# EAGLE design frontend_v2 (EAGLE 9.1.1)
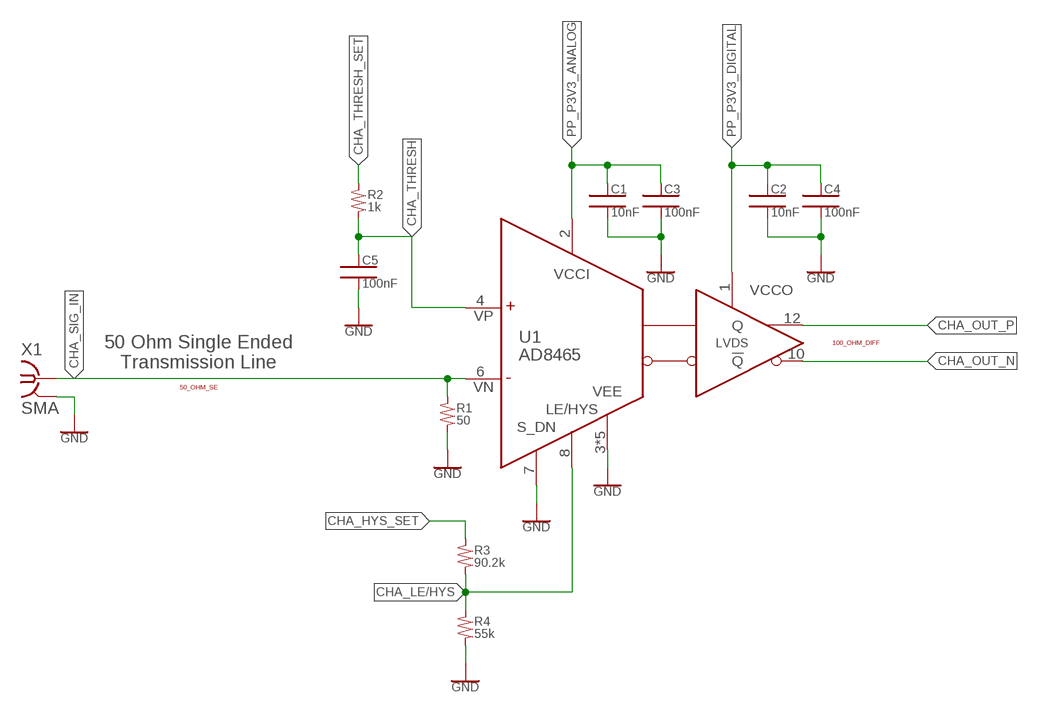
[diagram p0: schematic, sheet 1]

## Parts
C1  10nF  CAP_0402  [0402]
C2  10nF  CAP_0402  [0402]
C3  100nF  CAP_0402  [0402]
C4  100nF  CAP_0402  [0402]
C5  100nF  CAP_0402  [0402]
R1  50  RES_0402  [0402]
R2  1k  RES_0402  [0402]
R3  90.2k  RES_0402  [0402]
R4  55k  RES_0402  [0402]
U1  AD8465  [LFCSP-12]
X1  SMA  [J502-ND-142-0701-881/886]

## Nets
CHA_HYS_SET: R3.1
CHA_LE/HYS: R3.2 R4.1 U1.8(LE/HYS)
CHA_OUT_N [100_OHM_DIFF]: U1.10(!Q)
CHA_OUT_P [100_OHM_DIFF]: U1.12(Q)
CHA_SIG_IN: R1.1 U1.6(VN) X1.1
CHA_THRESH: C5.1 R2.2 U1.4(VP)
CHA_THRESH_SET: R2.1
GND: C1.2 C2.2 C3.2 C4.2 C5.2 R1.2 R4.2 U1.3(VEE) U1.5(VEE) U1.7(SDN) U1.9(VEE) U1.11(VEE) U1.EPAD(VEE) X1.G@1(GND) X1.G@2(GND) X1.G@3(GND) X1.G@4(GND)
PP_P3V3_ANALOG: C1.1 C3.1 U1.2(VCCI)
PP_P3V3_DIGITAL: C2.1 C4.1 U1.1(VCCO)

## Notes on the sheet
- 100_OHM_DIFF
- 50 Ohm Single Ended
  Transmission Line
- 50_OHM_SE

## Library data of the parts
C1-C5 = tcspc_lib:CAP
R1-R4 = tcspc_lib:RES
U1 = tcspc_lib:AD8465
X1 = tcspc_lib:SMA

## Net classes
1 50_OHM_SE: width 0.203 mm
2 100_OHM_DIFF: width 0.152 mm, clearance 0.29 mm

## Board
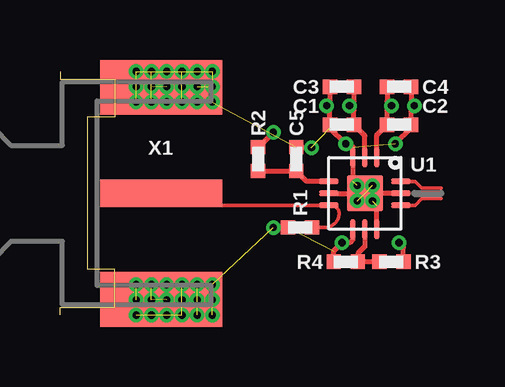
[diagram p1: board, top side]
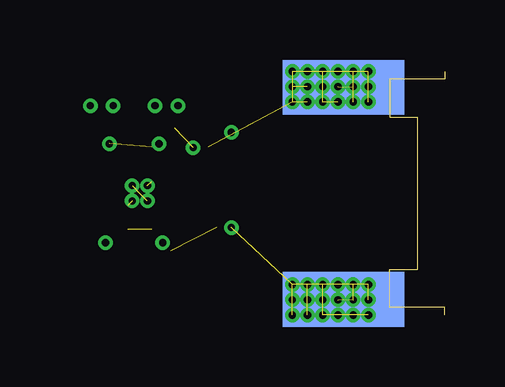
[diagram p2: board, bottom side, seen from below]

Size 2.29 x 10.16 mm. Coordinates in mm from the lower left corner, seen from the top.
Outline: 0,0 0,0.32 2.29,0.32 2.29,1.91 1.14,1.91 1.14,8.25 2.29,8.25 2.29,9.84 0,9.84 0,10.16
Copper layers (1+2*15+16): Top 0.035mm / dielectric 1.5mm / Route2 0.035mm / dielectric 0.15mm / Route15 0.035mm / dielectric 0.2mm / Bottom 0.035mm
Design rules "3PCB_4layer": minimum track width 6mil, minimum drill 0.3mm, track to track 6mil, track to pad 6mil, pad to pad 6mil, via to via 6mil, smd to smd 0mil, copper to edge 6mil, drill to drill 6mil, minimum pad ring 6mil, minimum via ring 6mil, stop-mask expansion 2mil, vias tented up to drill 0.3mm, thermal gap 10mil

### Footprints (pad centres in the part's own frame; a part is rotated, then mirrored left to right if it is on the bottom)
0402 = smd 0.6 x 0.6: 1 -0.5,0; 2 0.5,0
LFCSP-12 = smd 0.8 x 0.23: 1 -1.5,0.5; 2 -1.5,0; 3 -1.5,-0.5; 7 1.5,-0.5; 8 1.5,0; 9 1.5,0.5 | smd 0.23 x 0.8: 4 -0.5,-1.5; 5 0,-1.5; 6 0.5,-1.5; 10 0.5,1.5; 11 0,1.5; 12 -0.5,1.5 | smd 1.5 x 1.5: EPAD 0,0
J502-ND-142-0701-881/886 = smd 5.08 x 1.143: 1 2.565,0 | smd 5.08 x 2.286: G@1 2.565,4.42; G@2 2.565,-4.42 | smd 5.08 x 2.286 bottom: G@3 2.565,4.42; G@4 2.565,-4.42

### Placement (x,y rotation side)
C1  11.75,7.94 180 top  (outside the outline)
C2  14.13,7.94 0 top  (outside the outline)
C3  11.75,9.53 180 top  (outside the outline)
C4  14.13,9.53 0 top  (outside the outline)
C5  9.84,6.51 90 top  (outside the outline)
R1  10,3.65 180 top  (outside the outline)
R2  8.26,6.51 270 top  (outside the outline)
R3  13.81,2.22 180 top  (outside the outline)
R4  11.91,2.22 180 top  (outside the outline)
U1  12.7,5.08 270 top  (outside the outline)
X1  1.65,5.08 0 top

### Tracks (layer width: path | path; a pad name or v marks a point on that pad's centre or on a via)
CHA_HYS_SET  (via drill 0.3)
  Top 0.203: R3.1 14.31,2.83 v14.13,3.02
CHA_LE/HYS
  Top 0.203: U1.8 12.7,2.86 12.41,2.56 R4.1 R3.2
CHA_OUT_N
  Top 0.152: 15.88,4.86 15.08,4.86 14.8,4.58 U1.10
CHA_OUT_P
  Top 0.152: 15.88,5.3 15.08,5.3 14.8,5.58 U1.12
CHA_SIG_IN
  Top 0.152: 11.29,4.58 arc-90 11.63,4.25 arc-90 11.03,3.65 R1.1 | U1.6 4.72,4.58 X1.1
  Top 0.203: U1.6 11.29,4.58
CHA_THRESH
  Top 0.203: U1.4 10.27,5.58 C5.1 R2.2
CHA_THRESH_SET  (via drill 0.3)
  Top 0.203: R2.1 8.28,7.01 v8.89,7.62
GND  (via drill 0.3)  (48 unrouted)
  Top 0.203: U1.5 U1.EPAD | U1.9 13.2,4.58 U1.EPAD | U1.11 U1.EPAD | U1.EPAD 12.2,5.58 U1.3 12.2,7.01 12.06,7.14 v11.91,7.14 11.25,7.8 C1.2 11.25,8.6 v11.11,8.73 11.25,8.87 C3.2 | v13.97,7.14 14.63,7.8 C2.2 14.63,8.6 v14.76,8.73 14.63,8.87 C4.2 | U1.7 12.2,3.15 12.06,3.02 v11.75,3.02 11.41,2.68 R4.2 | C5.2 10.45,7.01 v10.48,6.99 | R1.2 v8.89,3.65
  other vias: 12.38,5.4 13.02,5.4 13.02,4.76 12.38,4.76 3.17,10.16 3.81,10.16 4.45,10.16 5.08,10.16 5.71,10.16 6.35,10.16 3.17,9.53 3.81,9.53 4.45,9.53 5.08,9.53 5.71,9.53 6.35,9.53 6.35,8.89 5.71,8.89 5.08,8.89 4.45,8.89 3.81,8.89 3.17,8.89 3.17,1.27 3.81,1.27 4.45,1.27 5.08,1.27 5.71,1.27 6.35,1.27 6.35,0.63 6.35,0 5.71,0 5.08,0 4.45,0 3.81,0 3.17,0 3.17,0.63 3.81,0.63 4.45,0.63 5.08,0.63 5.71,0.63
PP_P3V3_ANALOG  (via drill 0.3)
  Top 0.203: U1.2 12.7,7.48 C1.1 12.25,8.55 v12.06,8.73 12.25,8.91 C3.1
PP_P3V3_DIGITAL  (via drill 0.3)
  Top 0.203: U1.1 13.2,7.51 C2.1 13.63,8.55 v13.81,8.73 13.63,8.91 C4.1